# Altium schematic sheet DRAM+BANK1.SchDoc
size A2; SheetNumber: 4; SheetTotal: 8
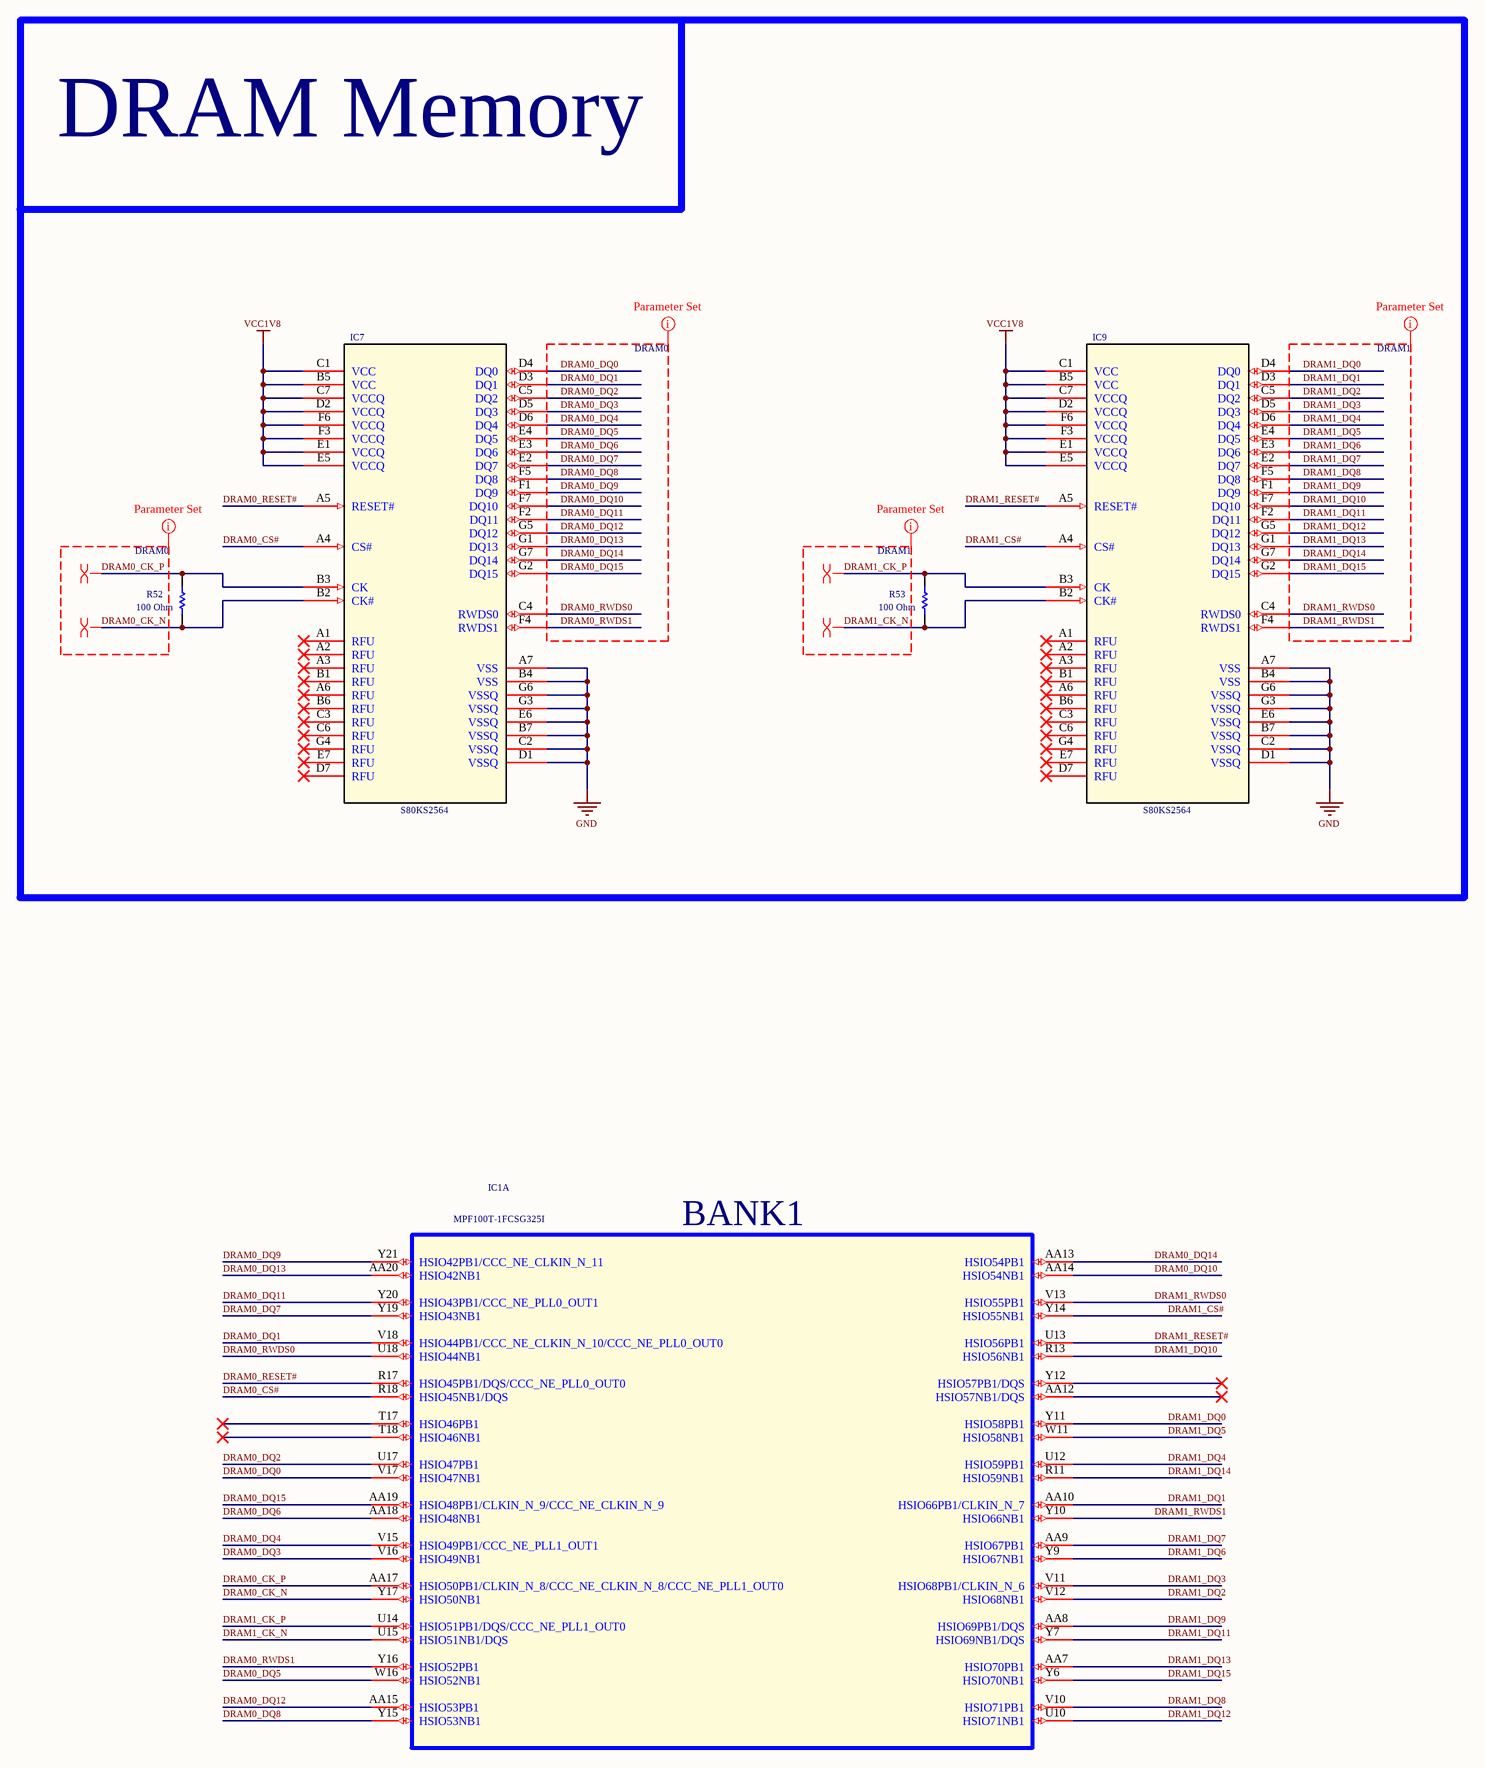
[diagram p0: DRAM+BANK1.SchDoc]

## Parts
IC1  MPF100T-1FCSG325I  [MPF100T-1FCSG325I]  (part A of 9)
IC7  S80KS2564  [S80KS2564]
IC9  S80KS2564  [S80KS2564]
R52  100 Ohm  [RESC1608X55X30LL15T15]
R53  100 Ohm  [RESC1608X55X30LL15T15]

## Blocks framed on the sheet
DRAM Memory: IC7 IC9 R52 R53

## Nets
GND: IC7.A7(VSS) IC7.B4(VSS) IC7.B7(VSSQ) IC7.C2(VSSQ) IC7.D1(VSSQ) IC7.E6(VSSQ) IC7.G3(VSSQ) IC7.G6(VSSQ) IC9.A7(VSS) IC9.B4(VSS) IC9.B7(VSSQ) IC9.C2(VSSQ) IC9.D1(VSSQ) IC9.E6(VSSQ) IC9.G3(VSSQ) IC9.G6(VSSQ)
VCC1V8: IC7.B5(VCC) IC7.C1(VCC) IC7.C7(VCCQ) IC7.D2(VCCQ) IC7.E1(VCCQ) IC7.E5(VCCQ) IC7.F3(VCCQ) IC7.F6(VCCQ) IC9.B5(VCC) IC9.C1(VCC) IC9.C7(VCCQ) IC9.D2(VCCQ) IC9.E1(VCCQ) IC9.E5(VCCQ) IC9.F3(VCCQ) IC9.F6(VCCQ)
DRAM0_CK_N: IC1.Y17(HSIO50NB1) IC7.B2(CK#) R52.1
DRAM0_CK_P: IC1.AA17(HSIO50PB1/CLKIN_N_8/CCC_NE_CLKIN_N_8/CCC_NE_PLL1_OUT0) IC7.B3(CK) R52.2
DRAM0_CS#: IC1.R18(HSIO45NB1/DQS) IC7.A4(CS#)
DRAM0_DQ0: IC1.V17(HSIO47NB1) IC7.D4(DQ0)
DRAM0_DQ1: IC1.V18(HSIO44PB1/CCC_NE_CLKIN_N_10/CCC_NE_PLL0_OUT0) IC7.D3(DQ1)
DRAM0_DQ2: IC1.U17(HSIO47PB1) IC7.C5(DQ2)
DRAM0_DQ3: IC1.V16(HSIO49NB1) IC7.D5(DQ3)
DRAM0_DQ4: IC1.V15(HSIO49PB1/CCC_NE_PLL1_OUT1) IC7.D6(DQ4)
DRAM0_DQ5: IC1.W16(HSIO52NB1) IC7.E4(DQ5)
DRAM0_DQ6: IC1.AA18(HSIO48NB1) IC7.E3(DQ6)
DRAM0_DQ7: IC1.Y19(HSIO43NB1) IC7.E2(DQ7)
DRAM0_DQ8: IC1.Y15(HSIO53NB1) IC7.F5(DQ8)
DRAM0_DQ9: IC1.Y21(HSIO42PB1/CCC_NE_CLKIN_N_11) IC7.F1(DQ9)
DRAM0_DQ10: IC1.AA14(HSIO54NB1) IC7.F7(DQ10)
DRAM0_DQ11: IC1.Y20(HSIO43PB1/CCC_NE_PLL0_OUT1) IC7.F2(DQ11)
DRAM0_DQ12: IC1.AA15(HSIO53PB1) IC7.G5(DQ12)
DRAM0_DQ13: IC1.AA20(HSIO42NB1) IC7.G1(DQ13)
DRAM0_DQ14: IC1.AA13(HSIO54PB1) IC7.G7(DQ14)
DRAM0_DQ15: IC1.AA19(HSIO48PB1/CLKIN_N_9/CCC_NE_CLKIN_N_9) IC7.G2(DQ15)
DRAM0_RESET#: IC1.R17(HSIO45PB1/DQS/CCC_NE_PLL0_OUT0) IC7.A5(RESET#)
DRAM0_RWDS0: IC1.U18(HSIO44NB1) IC7.C4(RWDS0)
DRAM0_RWDS1: IC1.Y16(HSIO52PB1) IC7.F4(RWDS1)
DRAM1_CK_N: IC1.U15(HSIO51NB1/DQS) IC9.B2(CK#) R53.1
DRAM1_CK_P: IC1.U14(HSIO51PB1/DQS/CCC_NE_PLL1_OUT0) IC9.B3(CK) R53.2
DRAM1_CS#: IC1.Y14(HSIO55NB1) IC9.A4(CS#)
DRAM1_DQ0: IC1.Y11(HSIO58PB1) IC9.D4(DQ0)
DRAM1_DQ1: IC1.AA10(HSIO66PB1/CLKIN_N_7) IC9.D3(DQ1)
DRAM1_DQ2: IC1.V12(HSIO68NB1) IC9.C5(DQ2)
DRAM1_DQ3: IC1.V11(HSIO68PB1/CLKIN_N_6) IC9.D5(DQ3)
DRAM1_DQ4: IC1.U12(HSIO59PB1) IC9.D6(DQ4)
DRAM1_DQ5: IC1.W11(HSIO58NB1) IC9.E4(DQ5)
DRAM1_DQ6: IC1.Y9(HSIO67NB1) IC9.E3(DQ6)
DRAM1_DQ7: IC1.AA9(HSIO67PB1) IC9.E2(DQ7)
DRAM1_DQ8: IC1.V10(HSIO71PB1) IC9.F5(DQ8)
DRAM1_DQ9: IC1.AA8(HSIO69PB1/DQS) IC9.F1(DQ9)
DRAM1_DQ10: IC1.R13(HSIO56NB1) IC9.F7(DQ10)
DRAM1_DQ11: IC1.Y7(HSIO69NB1/DQS) IC9.F2(DQ11)
DRAM1_DQ12: IC1.U10(HSIO71NB1) IC9.G5(DQ12)
DRAM1_DQ13: IC1.AA7(HSIO70PB1) IC9.G1(DQ13)
DRAM1_DQ14: IC1.R11(HSIO59NB1) IC9.G7(DQ14)
DRAM1_DQ15: IC1.Y6(HSIO70NB1) IC9.G2(DQ15)
DRAM1_RESET#: IC1.U13(HSIO56PB1) IC9.A5(RESET#)
DRAM1_RWDS0: IC1.V13(HSIO55PB1) IC9.C4(RWDS0)
DRAM1_RWDS1: IC1.Y10(HSIO66NB1) IC9.F4(RWDS1)

Not connected (* = marked no-connect by the designer): IC1 AA12(HSIO57NB1/DQS)* T17(HSIO46PB1)* T18(HSIO46NB1)* Y12(HSIO57PB1/DQS)*; IC7 A1(RFU)* A2(RFU)* A3(RFU)* A6(RFU)* B1(RFU)* B6(RFU)* C3(RFU)* C6(RFU)* D7(RFU)* E7(RFU)* G4(RFU)*; IC9 A1(RFU)* A2(RFU)* A3(RFU)* A6(RFU)* B1(RFU)* B6(RFU)* C3(RFU)* C6(RFU)* D7(RFU)* E7(RFU)* G4(RFU)*

## Layout directives
differential pair: DRAM0_CK_N, DRAM0_CK_P, DRAM1_CK_N, DRAM1_CK_P
net class DRAM0: DRAM0_CK_N, DRAM0_CK_P, DRAM0_DQ0, DRAM0_DQ1, DRAM0_DQ2, DRAM0_DQ3, DRAM0_DQ4, DRAM0_DQ5, DRAM0_DQ6, DRAM0_DQ7, DRAM0_DQ8, DRAM0_DQ9, DRAM0_DQ10, DRAM0_DQ11, DRAM0_DQ12, DRAM0_DQ13, DRAM0_DQ14, DRAM0_DQ15, DRAM0_RWDS0, DRAM0_RWDS1
net class DRAM1: DRAM1_CK_N, DRAM1_CK_P, DRAM1_DQ0, DRAM1_DQ1, DRAM1_DQ2, DRAM1_DQ3, DRAM1_DQ4, DRAM1_DQ5, DRAM1_DQ6, DRAM1_DQ7, DRAM1_DQ8, DRAM1_DQ9, DRAM1_DQ10, DRAM1_DQ11, DRAM1_DQ12, DRAM1_DQ13, DRAM1_DQ14, DRAM1_DQ15, DRAM1_RWDS0, DRAM1_RWDS1

## Notes on the sheet
- (in symbol MPF100T-1FCSG325I, part A) BANK1

## Library data of the parts
IC1 = MPF100T-1FCSG325I: Part_Number: J00001; Part_Name: Jumper; ID: 110; Mounting_Type: SMT; ComponentLink1Description: Datasheet
IC7 IC9 = S80KS2564: Jumper; Part_Number: J00001; ID: 110; Mounting_Type: SMT; Part_Name: Jumper; ComponentLink1Description: Datasheet
R52 R53 = CMP-2000-00179-1: Manufacturer: Panasonic; Part Number: ERJ-3EKF1000V; Manufacturer Part Number: ERJ3EKF1000V